# Altium schematic sheet gps.SchDoc
size A; SheetNumber: 4; SheetTotal: 9
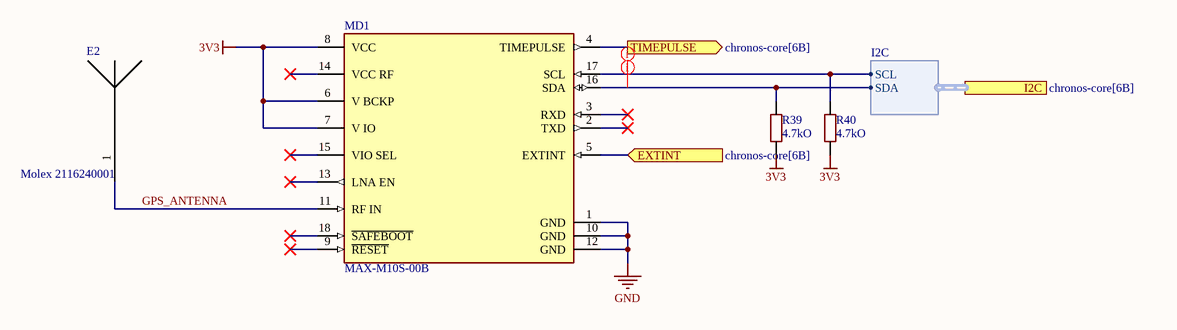
[diagram p0: gps.SchDoc]

## Parts
E2  Molex 2116240001  [Molex_GPS_L1_L5_GLONASS_36MM_STACKED_2116240001]
MD1  MAX-M10S-00B  [FP-MAX-M10S-00B-MFG]
R39  value 4.7kO  [0402WGF4701TCE]  (hidden comment: 0402WGF4701TCE)
R40  value 4.7kO  [0402WGF4701TCE]  (hidden comment: 0402WGF4701TCE)

## Ports
EXTINT (in, see chronos-core[6B]), I2C (harness I2C, see chronos-core[6B]), TIMEPULSE (out, see chronos-core[6B])

## Harnesses
I2C: SCL, SDA

## Nets
3V3: MD1.6(V_BCKP) MD1.7(V_IO) MD1.8(VCC) R39.1 R40.1
GND: MD1.1(GND) MD1.10(GND) MD1.12(GND)
EXTINT: MD1.5(EXTINT) ; port EXTINT
GPS_ANTENNA: E2.1(ANT) MD1.11(RF_IN)
TIMEPULSE: MD1.4(TIMEPULSE) ; port TIMEPULSE
NetMD1_16: MD1.16(SDA) R39.2 ; port I2C.SDA
NetMD1_17: MD1.17(SCL) R40.2 ; port I2C.SCL

Not connected (* = marked no-connect by the designer): MD1 2(TXD)* 3(RXD)* 9(~{RESET})* 13(LNA_EN)* 14(VCC_RF)* 15(VIO_SEL)* 18(~{SAFEBOOT})*

## Layout directives
net class GPS_I2C: NetMD1_16, NetMD1_17

## Library data of the parts
E2 = Molex_GPS_L1_L5_GLONASS_36MM_STACKED_2116240001: Supplier 1: Newark; Supplier Part Number 1: 211624-0001; ComponentLink1Description: Suppler 2; ComponentLink1URL: JLCPCB; ComponentLink2Description: Suppler Part Number 2; ComponentLink2URL: C177230
MD1 = CMP-207130-000026-1: GNSS LCC RX, ROM, TCXO, LNA, SAW
R39 R40 = 0402WGF4701TCE: Resistors. -55C~+155C 4.7kohm 50V 62.5mW Thick Film Resistor +/-1% +/-100ppm/C 0402 Chip Resistor - Surface Mount ROHS; Manufacturer: UNI-ROYAL(Uniroyal Elec); Component Type: Resistors; Design Item ID: 0402WGF4701TCE; JLCPCB Part #: C25900; Manufacturer Part Number: 0402WGF4701TCE